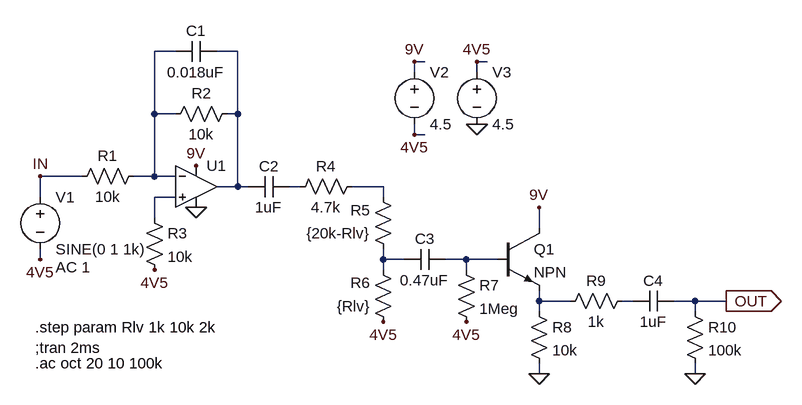
[diagram p0: schematic OD-1_LEVEL.asc]
OD-1_LEVEL.asc, the LTspice schematic file:
Version 4
SHEET 1 1076 680
WIRE 112 -80 80 -80
WIRE 208 -80 176 -80
WIRE 496 -64 480 -64
WIRE 592 -64 576 -64
WIRE 480 -48 480 -64
WIRE 576 -48 576 -64
WIRE 80 16 80 -80
WIRE 112 16 80 16
WIRE 208 16 208 -80
WIRE 208 16 192 16
WIRE 480 48 480 32
WIRE 496 48 480 48
WIRE -32 112 -96 112
WIRE 80 112 80 16
WIRE 80 112 48 112
WIRE 112 112 80 112
WIRE 208 128 208 16
WIRE 208 128 176 128
WIRE 224 128 208 128
WIRE 304 128 288 128
WIRE 432 128 384 128
WIRE -96 144 -96 112
WIRE 112 144 80 144
WIRE 432 144 432 128
WIRE 80 176 80 144
WIRE 672 192 672 160
WIRE -96 240 -96 224
WIRE 432 240 432 224
WIRE 464 240 432 240
WIRE 560 240 528 240
WIRE 608 240 560 240
WIRE 432 256 432 240
WIRE 560 256 560 240
WIRE 672 304 672 288
WIRE 720 304 672 304
WIRE 816 304 800 304
WIRE 912 304 880 304
WIRE 960 304 912 304
WIRE 672 320 672 304
WIRE 912 320 912 304
WIRE 672 416 672 400
WIRE 912 416 912 400
FLAG 80 256 4V5
FLAG 432 336 4V5
FLAG 672 160 9V
FLAG 672 416 0
FLAG 560 336 4V5
FLAG 912 416 0
FLAG 960 304 OUT
IOPIN 960 304 Out
FLAG -96 240 4V5
FLAG -96 112 IN
FLAG 144 96 9V
FLAG 144 160 0
FLAG 576 32 0
FLAG 480 -64 9V
FLAG 480 48 4V5
FLAG 576 -64 4V5
SYMBOL Opamps\\UniversalOpamp2 144 128 R0
SYMATTR InstName U1
SYMBOL res 64 96 R90
WINDOW 0 0 56 VBottom 2
WINDOW 3 32 56 VTop 2
SYMATTR InstName R1
SYMATTR Value 10k
SYMBOL res 208 0 R90
WINDOW 0 0 56 VBottom 2
WINDOW 3 32 56 VTop 2
SYMATTR InstName R2
SYMATTR Value 10k
SYMBOL cap 176 -96 R90
WINDOW 0 0 32 VBottom 2
WINDOW 3 32 32 VTop 2
SYMATTR InstName C1
SYMATTR Value 0.018uF
SYMBOL res 64 160 R0
SYMATTR InstName R3
SYMATTR Value 10k
SYMBOL cap 288 112 R90
WINDOW 0 0 32 VBottom 2
WINDOW 3 32 32 VTop 2
SYMATTR InstName C2
SYMATTR Value 1uF
SYMBOL res 400 112 R90
WINDOW 0 0 56 VBottom 2
WINDOW 3 32 56 VTop 2
SYMATTR InstName R4
SYMATTR Value 4.7k
SYMBOL res 448 240 R180
WINDOW 0 36 76 Left 2
WINDOW 3 36 40 Left 2
SYMATTR InstName R5
SYMATTR Value {20k-Rlv}
SYMBOL res 448 352 R180
WINDOW 0 36 76 Left 2
WINDOW 3 36 40 Left 2
SYMATTR InstName R6
SYMATTR Value {Rlv}
SYMBOL cap 528 224 R90
WINDOW 0 0 32 VBottom 2
WINDOW 3 32 32 VTop 2
SYMATTR InstName C3
SYMATTR Value 0.47uF
SYMBOL res 544 240 R0
SYMATTR InstName R7
SYMATTR Value 1Meg
SYMBOL npn 608 192 R0
SYMATTR InstName Q1
SYMBOL res 656 304 R0
SYMATTR InstName R8
SYMATTR Value 10k
SYMBOL res 816 288 R90
WINDOW 0 0 56 VBottom 2
WINDOW 3 32 56 VTop 2
SYMATTR InstName R9
SYMATTR Value 1k
SYMBOL cap 880 288 R90
WINDOW 0 0 32 VBottom 2
WINDOW 3 32 32 VTop 2
SYMATTR InstName C4
SYMATTR Value 1uF
SYMBOL res 896 304 R0
SYMATTR InstName R10
SYMATTR Value 100k
SYMBOL voltage -96 128 R0
WINDOW 123 24 124 Left 2
WINDOW 39 0 0 Left 2
SYMATTR Value2 AC 1
SYMATTR InstName V1
SYMATTR Value SINE(0 1 1k)
SYMBOL voltage 480 -64 R0
WINDOW 123 0 0 Left 2
WINDOW 39 0 0 Left 2
SYMATTR InstName V2
SYMATTR Value 4.5
SYMBOL voltage 576 -64 R0
WINDOW 123 0 0 Left 2
WINDOW 39 0 0 Left 2
SYMATTR InstName V3
SYMATTR Value 4.5
TEXT -104 376 Left 2 !;tran 2ms
TEXT -104 344 Left 2 !.step param Rlv 1k 10k 2k
TEXT -104 400 Left 2 !.ac oct 20 10 100k

The netlist it stands for:
* OD-1_LEVEL.asc
XU1 N005 N001 9V 0 N002 level.2 Avol=1Meg GBW=10Meg Slew=10Meg ilimit=25m rail=0 Vos=0 phimargin=45 en=0 enk=0 in=0 ink=0 Rin=500Meg  ; pins IN+ IN- V+ V- OUT
R1 N001 IN 10k
R2 N002 N001 10k
C1 N002 N001 0.018uF
R3 N005 4V5 10k
C2 N003 N002 1uF
R4 N004 N003 4.7k
R5 N006 N004 {20k-Rlv}
R6 4V5 N006 {Rlv}
C3 N007 N006 0.47uF
R7 N007 4V5 1Meg
Q1 9V N007 N008 0 NPN
R8 N008 0 10k
R9 N009 N008 1k
C4 OUT N009 1uF
R10 OUT 0 100k
V1 IN 4V5 SINE(0 1 1k) AC 1
V2 9V 4V5 4.5
V3 4V5 0 4.5
.model NPN NPN
.model PNP PNP
.lib standard.bjt
;tran 2ms
.step param Rlv 1k 10k 2k
.ac oct 20 10 100k
.lib UniversalOpamps2.sub
.backanno
.end